# Altium schematic sheet Sheet_Power.SchDoc
size A4
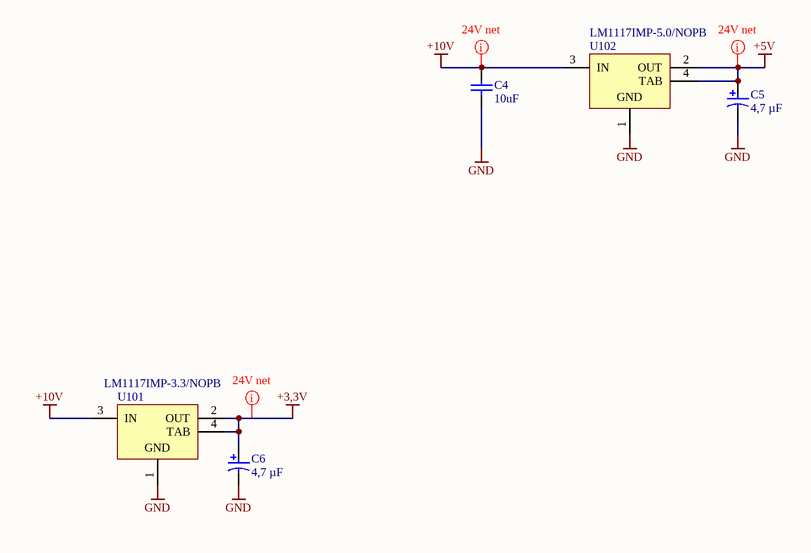
[diagram p0: Sheet_Power.SchDoc]

## Parts
C4  10uF  [CAPC1206(3216)190_N]
C5  4,7 µF  [A Package]
C6  4,7 µF  [A Package]
U101  LM1117IMP-3.3/NOPB  [DCY0004A_N]
U102  LM1117IMP-5.0/NOPB  [DCY0004A_M]

## Nets
+3,3V: C6.1 U101.2(OUT) U101.4(TAB)
+5V: C5.1 U102.2(OUT) U102.4(TAB)
+10V: C4.2 U101.3(IN) U102.3(IN)
GND: C4.1 C5.2 C6.2 U101.1(GND) U102.1(GND)

## Layout directives
net class 24V_net: +3,3V, +5V, +10V

## Library data of the parts
C4 = CMP-00471-2: CAP 10uF 25V -20% to +80% 1206 (3216 Metric) Thickness 1.9mm SMD; Manufacturer: Wurth Electronics Inc.; Manufacturer Part Number: 885012208069; PartNumber: 885 012 208 069; Case-EIA: 1206; Case-Metric: 3216; Temperature Coefficient: X7R; Value: 10uF; Tolerance: -20% to +80%; Max Thickness: 1.9 mm; Rated Voltage: 25 V; Technology: SMT; ComponentLink1Description: 885012208069.pdf; ComponentLink1URL: http://katalog.we-online.de/pbs/datasheet/885012208069.pdf; Mounting Type: Surface Mount, MLCC; Operating Temperature: -55°C ~ 125°C; Package / Case: 1206 (3216 Metric); Packaging: Tape & Reel (TR); Part Status: Active; Size / Dimension: 0.126" L x 0.063" W (3.20mm x 1.60mm); Supplier: Digi-Key; Supplier Part Number: 732-7574-2-ND; Thickness (Max): 0.075" (1.90mm)
C5 C6 = CMP-001-0039-3: 4,7 µF; 6V; Gr. A; T491A475K006AT; Manufacturer: KEMET; Capacitance: 4.7µF; ESR (Equivalent Series Resistance): 6 Ohm; Lifetime @ Temp.: 2000 Hrs @ 85°C; Tolerance: ±10%; Type: Molded; Voltage - Rated: 6.3V; ComponentLink1Description: KEM_T2005_T491.pdf; ComponentLink1URL: http://www.kemet.com/Lists/ProductCatalog/Attachments/254/KEM_T2005_T491.pdf; Failure Rate: -; Features: General Purpose; Height - Seated (Max): 0.071" (1.80mm); Lead Spacing: -; Manufacturer Size Code: A; Mounting Type: Surface Mount; Operating Temperature: -55°C ~ 125°C; Package / Case: 1206 (3216 Metric); Packaging: Cut Tape (CT); Part Status: Active; Size / Dimension: 0.126" L x 0.063" W (3.20mm x 1.60mm); Supplier: Digi-Key; Supplier Part Number: 399-9717-1-ND; PartNumber: T491A475K006AT
U101 = CMP-00484-1: 800mA Low-Dropout Linear Regulator, 4-pin SOT-223, Pb-Free; Manufacturer: Texas Instruments; PackageTopMarking: XYTT*N05B; PowerWise: N; High-Reliability: Y; CompType: LDO IC; Code_IPC: SOT223-4; PackageReference: DCY0004A; PinCount: 4; PackageDescription: Molded SOT-223, 6.50 x 3.56 x 1.6mm Body, 4 Lead, 2.3mm Pitch; PartNumber: LM1117IMP-3.3/NOPB; RoHS: Y; ComponentLink1Description: Datasheet URL; Code_JEDEC: TO-261-AA; ComponentLink1URL: http://www.ti.com/general/docs/lit/getliterature.tsp?genericPartNumber=LM1117-N&fileType=pdf
U102 = CMP-00485-1: 800mA Low-Dropout Linear Regulator, 4-pin SOT-223, Pb-Free; Manufacturer: Texas Instruments; PackageTopMarking: XYTT*N06B; CompType: LDO IC; PowerWise: N; High-Reliability: Y; RoHS: Y; Code_JEDEC: TO-261-AA; ComponentLink1URL: http://www.ti.com/general/docs/lit/getliterature.tsp?genericPartNumber=LM1117-N&fileType=pdf; Code_IPC: SOT223-4; ComponentLink1Description: Datasheet URL; PartNumber: LM1117IMP-5.0/NOPB; PackageReference: DCY0004A; PinCount: 4; PackageDescription: Molded SOT-223, 6.50 x 3.56 x 1.6mm Body, 4 Lead, 2.3mm Pitch